# EAGLE design solderable_breadboard_mini (EAGLE 6.5.0)
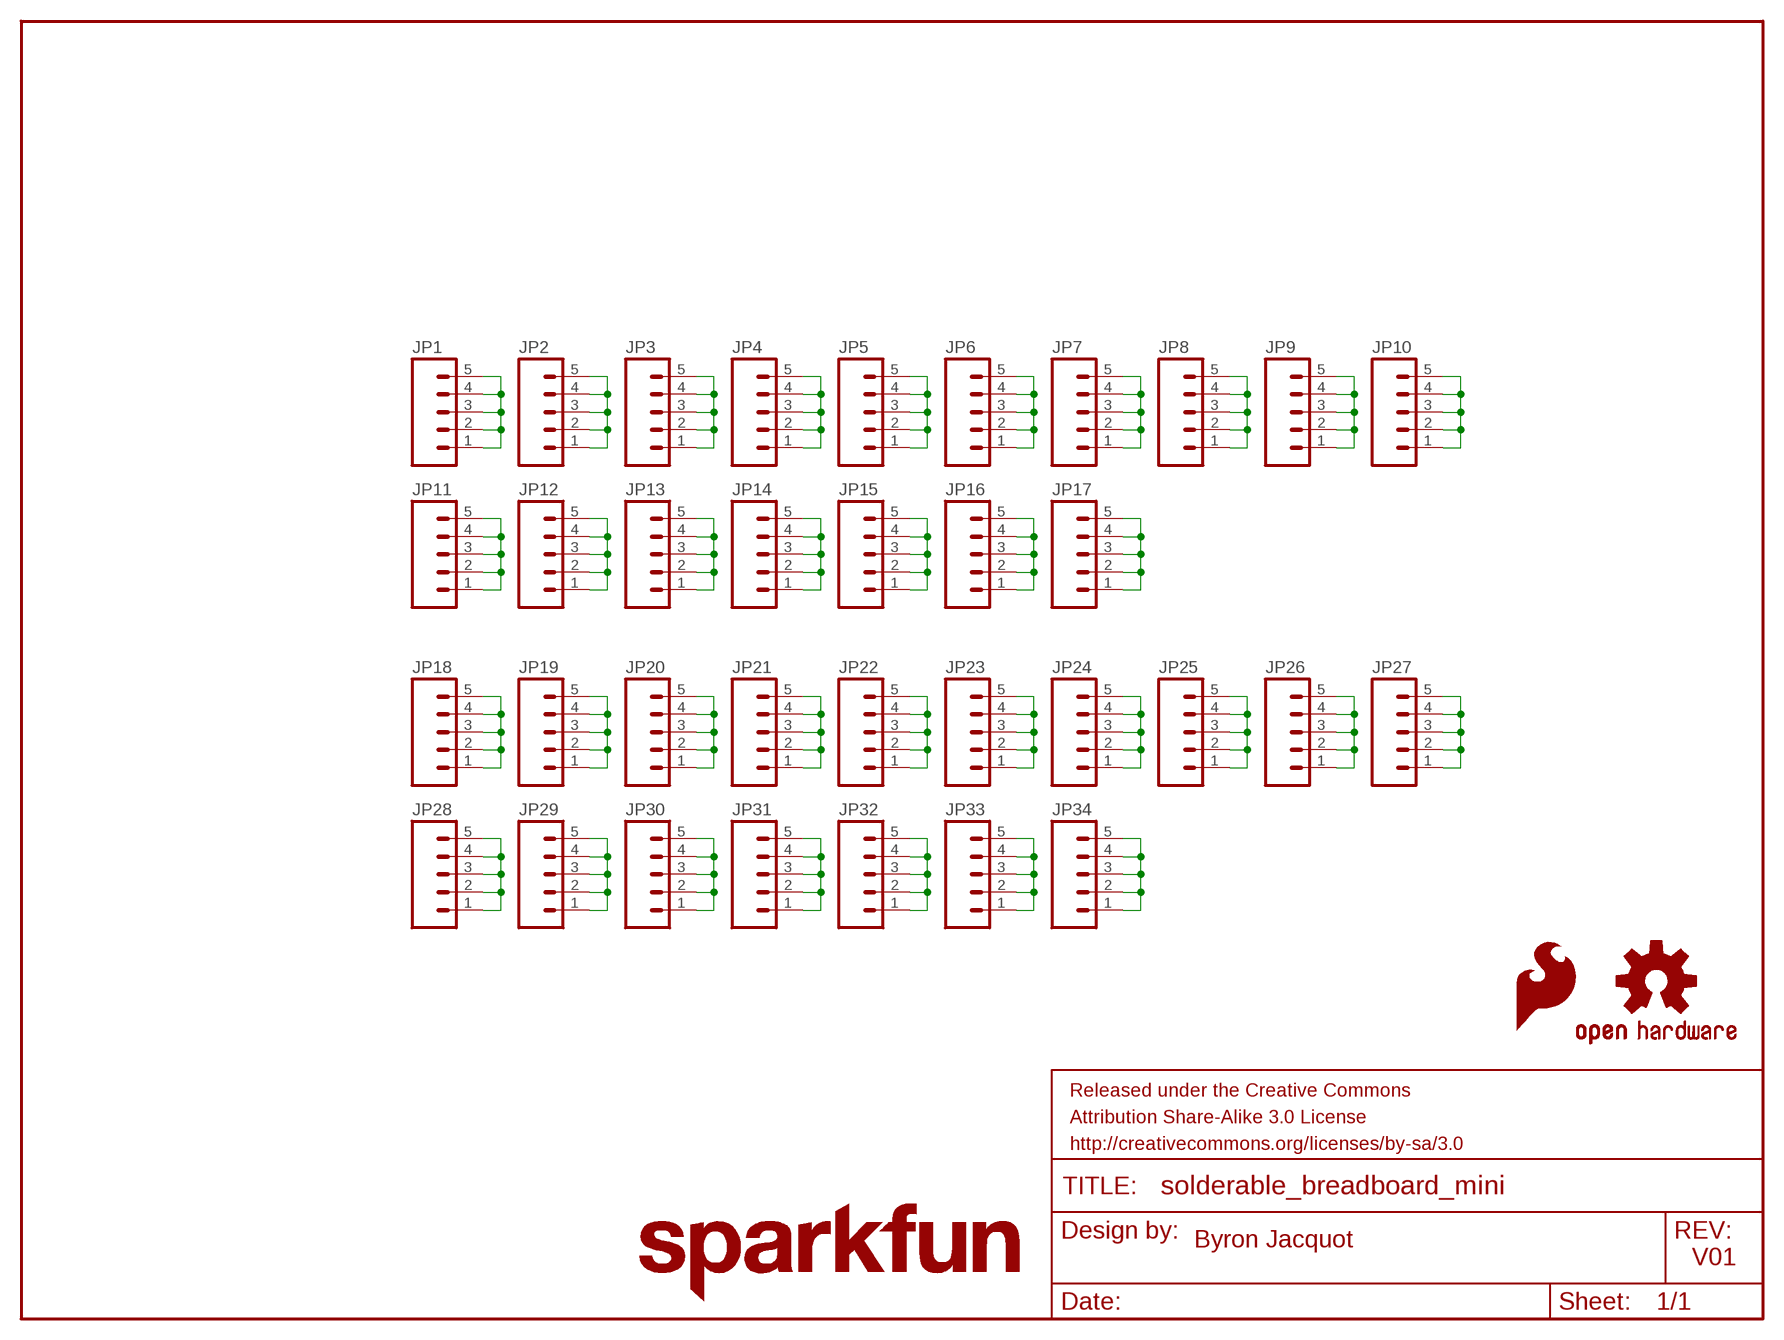
[diagram p0: schematic, sheet 1]

## Parts
FRAME1  FRAME-LETTER  [CREATIVE_COMMONS]
JP1  M05NO_SILK  [1X05_NO_SILK]
JP2  M05NO_SILK  [1X05_NO_SILK]
JP3  M05NO_SILK  [1X05_NO_SILK]
JP4  M05NO_SILK  [1X05_NO_SILK]
JP5  M05NO_SILK  [1X05_NO_SILK]
JP6  M05NO_SILK  [1X05_NO_SILK]
JP7  M05NO_SILK  [1X05_NO_SILK]
JP8  M05NO_SILK  [1X05_NO_SILK]
JP9  M05NO_SILK  [1X05_NO_SILK]
JP10  M05NO_SILK  [1X05_NO_SILK]
JP11  M05NO_SILK  [1X05_NO_SILK]
JP12  M05NO_SILK  [1X05_NO_SILK]
JP13  M05NO_SILK  [1X05_NO_SILK]
JP14  M05NO_SILK  [1X05_NO_SILK]
JP15  M05NO_SILK  [1X05_NO_SILK]
JP16  M05NO_SILK  [1X05_NO_SILK]
JP17  M05NO_SILK  [1X05_NO_SILK]
JP18  M05NO_SILK  [1X05_NO_SILK]
JP19  M05NO_SILK  [1X05_NO_SILK]
JP20  M05NO_SILK  [1X05_NO_SILK]
JP21  M05NO_SILK  [1X05_NO_SILK]
JP22  M05NO_SILK  [1X05_NO_SILK]
JP23  M05NO_SILK  [1X05_NO_SILK]
JP24  M05NO_SILK  [1X05_NO_SILK]
JP25  M05NO_SILK  [1X05_NO_SILK]
JP26  M05NO_SILK  [1X05_NO_SILK]
JP27  M05NO_SILK  [1X05_NO_SILK]
JP28  M05NO_SILK  [1X05_NO_SILK]
JP29  M05NO_SILK  [1X05_NO_SILK]
JP30  M05NO_SILK  [1X05_NO_SILK]
JP31  M05NO_SILK  [1X05_NO_SILK]
JP32  M05NO_SILK  [1X05_NO_SILK]
JP33  M05NO_SILK  [1X05_NO_SILK]
JP34  M05NO_SILK  [1X05_NO_SILK]
LOGO1  SFE_LOGO_NAME.1_INCH  [SFE_LOGO_NAME_.1]
LOGO2  OSHW-LOGOM  [OSHW-LOGO-M]
LOGO3  SFE_LOGO_FLAME.1_INCH  [SFE_LOGO_FLAME_.1]
LOGO4  SFE_LOGO_FLAME.1_INCH  [SFE_LOGO_FLAME_.1]

## Nets
N$1: JP1.1 JP1.2 JP1.3 JP1.4 JP1.5
N$2: JP2.1 JP2.2 JP2.3 JP2.4 JP2.5
N$3: JP3.1 JP3.2 JP3.3 JP3.4 JP3.5
N$4: JP4.1 JP4.2 JP4.3 JP4.4 JP4.5
N$5: JP5.1 JP5.2 JP5.3 JP5.4 JP5.5
N$6: JP6.1 JP6.2 JP6.3 JP6.4 JP6.5
N$7: JP7.1 JP7.2 JP7.3 JP7.4 JP7.5
N$8: JP8.1 JP8.2 JP8.3 JP8.4 JP8.5
N$9: JP9.1 JP9.2 JP9.3 JP9.4 JP9.5
N$10: JP10.1 JP10.2 JP10.3 JP10.4 JP10.5
N$11: JP11.1 JP11.2 JP11.3 JP11.4 JP11.5
N$12: JP12.1 JP12.2 JP12.3 JP12.4 JP12.5
N$13: JP13.1 JP13.2 JP13.3 JP13.4 JP13.5
N$14: JP14.1 JP14.2 JP14.3 JP14.4 JP14.5
N$15: JP15.1 JP15.2 JP15.3 JP15.4 JP15.5
N$16: JP16.1 JP16.2 JP16.3 JP16.4 JP16.5
N$17: JP17.1 JP17.2 JP17.3 JP17.4 JP17.5
N$18: JP18.1 JP18.2 JP18.3 JP18.4 JP18.5
N$19: JP19.1 JP19.2 JP19.3 JP19.4 JP19.5
N$20: JP20.1 JP20.2 JP20.3 JP20.4 JP20.5
N$21: JP21.1 JP21.2 JP21.3 JP21.4 JP21.5
N$22: JP22.1 JP22.2 JP22.3 JP22.4 JP22.5
N$23: JP23.1 JP23.2 JP23.3 JP23.4 JP23.5
N$24: JP24.1 JP24.2 JP24.3 JP24.4 JP24.5
N$25: JP25.1 JP25.2 JP25.3 JP25.4 JP25.5
N$26: JP26.1 JP26.2 JP26.3 JP26.4 JP26.5
N$27: JP27.1 JP27.2 JP27.3 JP27.4 JP27.5
N$28: JP28.1 JP28.2 JP28.3 JP28.4 JP28.5
N$29: JP29.1 JP29.2 JP29.3 JP29.4 JP29.5
N$30: JP30.1 JP30.2 JP30.3 JP30.4 JP30.5
N$31: JP31.1 JP31.2 JP31.3 JP31.4 JP31.5
N$32: JP32.1 JP32.2 JP32.3 JP32.4 JP32.5
N$33: JP33.1 JP33.2 JP33.3 JP33.4 JP33.5
N$34: JP34.1 JP34.2 JP34.3 JP34.4 JP34.5

## Notes on the sheet
- Byron Jacquot
- V01

## Library data of the parts
FRAME1 = SparkFun-Aesthetics:FRAME-LETTER: Schematic Frame Standard 8.5x11 US Letter frame
JP1-JP34 = SparkFun-Connectors:M05: Header 5 Standard 5-pin 0.1" header. Use with straight break away headers (SKU : PRT-00116), right angle break away headers (PRT-00553), swiss pins (PRT-00743), machine pins (PRT-00117), and female headers (PRT-00115). Molex polarized connector foot print use with SKU : PRT-08230 with associated crimp pins and housings.
LOGO1 = SparkFun-Aesthetics:SFE_LOGO_NAME: SFE Logo, name only This is the SparkFun name logo. The logo on the schematic will always be the same size; the package variant is the height of the flame part of the logo (or the height the flame would be, if it were drawn). Default layer for the logo on the board is tSilk.
LOGO2 = SparkFun-Aesthetics:OSHW-LOGO: Open Source Hardware Logo This logo indicates the piece of hardware it is found on incorporates a OSHW license and/or adheres to the definition of open source hardware found here: http://freedomdefined.org/OSHW
LOGO3 LOGO4 = SparkFun-Aesthetics:SFE_LOGO_FLAME: SFE Logo, flame only This is the SparkFun flame logo. The logo on the schematic will always be the same size; the package variant is the height of the flame. Default layer for the logo on the board is tSilk.

## Board
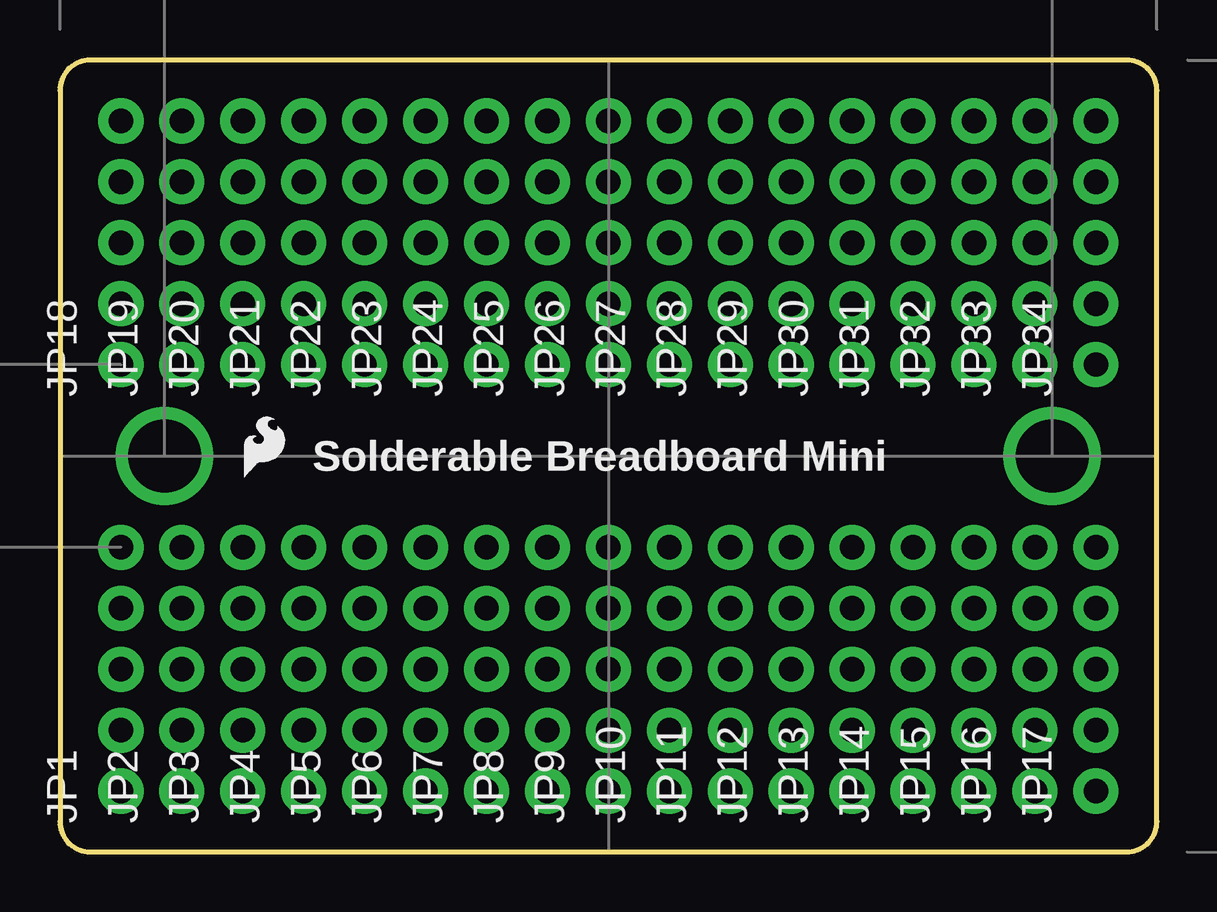
[diagram p1: board, top side]
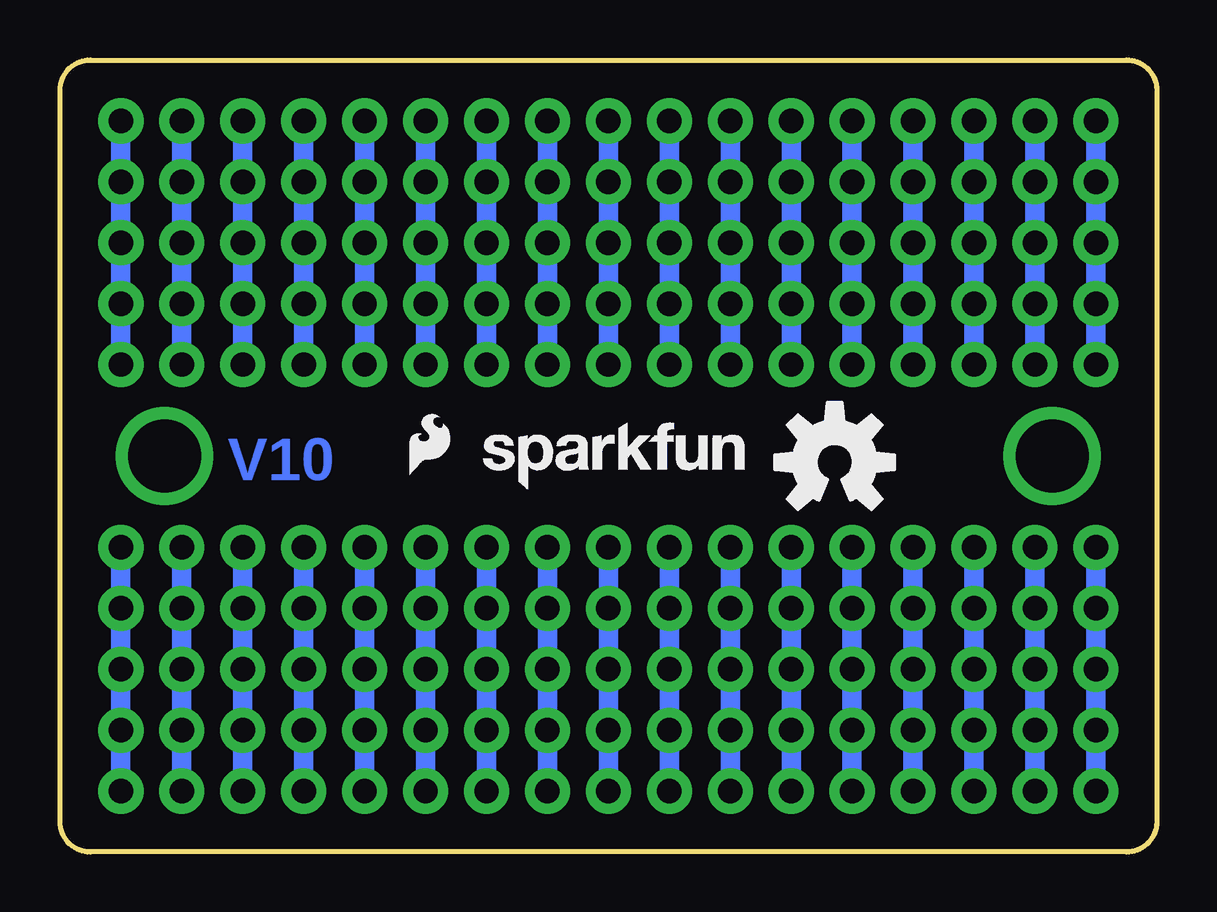
[diagram p2: board, bottom side, seen from below]

Size 45.72 x 33.02 mm. Coordinates in mm from the lower left corner, seen from the top.
Outline: 0,31.75 0,1.27 arc90 1.27,0 44.45,0 arc90 45.72,1.27 45.72,31.75 arc90 44.45,33.02 1.27,33.02 arc90 0,31.75
Copper layers (1*16): Top 0.035mm / dielectric 1.5mm / Bottom 0.035mm
Design rules "SparkFun-2-layer": minimum track width 7mil, minimum drill 15mil, track to track 8mil, track to pad 8mil, pad to pad 8mil, via to via 8mil, smd to smd 8mil, copper to edge 8mil, drill to drill 8mil, minimum pad ring 12mil, minimum via ring 10mil, stop-mask expansion 4mil, vias tented up to drill 20mil, thermal gap 10mil

### Footprints (pad centres in the part's own frame; a part is rotated, then mirrored left to right if it is on the bottom)
1X05_NO_SILK = drill 1.016 pad 1.88: 1 0,0; 2 2.54,0; 3 5.08,0; 4 7.62,0; 5 10.16,0

### Placement (x,y rotation side)
FRAME1  5.08,-10.16 0 top  (outside the outline)
JP1  2.54,2.54 90 top
JP2  5.08,2.54 90 top
JP3  7.62,2.54 90 top
JP4  10.16,2.54 90 top
JP5  12.7,2.54 90 top
JP6  15.24,2.54 90 top
JP7  17.78,2.54 90 top
JP8  20.32,2.54 90 top
JP9  22.86,2.54 90 top
JP10  25.4,2.54 90 top
JP11  27.94,2.54 90 top
JP12  30.48,2.54 90 top
JP13  33.02,2.54 90 top
JP14  35.56,2.54 90 top
JP15  38.1,2.54 90 top
JP16  40.64,2.54 90 top
JP17  43.18,2.54 90 top
JP18  2.54,20.32 90 top
JP19  5.08,20.32 90 top
JP20  7.62,20.32 90 top
JP21  10.16,20.32 90 top
JP22  12.7,20.32 90 top
JP23  15.24,20.32 90 top
JP24  17.78,20.32 90 top
JP25  20.32,20.32 90 top
JP26  22.86,20.32 90 top
JP27  25.4,20.32 90 top
JP28  27.94,20.32 90 top
JP29  30.48,20.32 90 top
JP30  33.02,20.32 90 top
JP31  35.56,20.32 90 top
JP32  38.1,20.32 90 top
JP33  40.64,20.32 90 top
JP34  43.18,20.32 90 top
LOGO1  28.57,14.61 0 bottom
LOGO2  13.43,16.26 0 bottom
LOGO3  7.37,15.27 0 top
LOGO4  31.46,15.37 0 bottom

### Tracks (layer width: path | path; a pad name or v marks a point on that pad's centre or on a via)
N$1
  Bottom 0.813: JP1.1 JP1.2 JP1.3 JP1.4 JP1.5
N$2
  Bottom 0.813: JP2.5 JP2.4 JP2.3 JP2.2 JP2.1
N$3
  Bottom 0.813: JP3.1 JP3.2 JP3.3 JP3.4 JP3.5
N$4
  Bottom 0.813: JP4.1 JP4.2 JP4.3 JP4.4 JP4.5
N$5
  Bottom 0.813: JP5.1 JP5.2 JP5.3 JP5.4 JP5.5
N$6
  Bottom 0.813: JP6.1 JP6.2 JP6.3 JP6.4 JP6.5
N$7
  Bottom 0.813: JP7.5 JP7.4 JP7.3 JP7.2 JP7.1
N$8
  Bottom 0.813: JP8.1 JP8.2 JP8.3 JP8.4 JP8.5
N$9
  Bottom 0.813: JP9.5 JP9.4 JP9.3 JP9.2 JP9.1
N$10
  Bottom 0.813: JP10.1 JP10.2 JP10.3 JP10.4 JP10.5
N$11
  Bottom 0.813: JP11.5 JP11.4 JP11.3 JP11.2 JP11.1
N$12
  Bottom 0.813: JP12.1 JP12.2 JP12.3 JP12.4 JP12.5
N$13
  Bottom 0.813: JP13.5 JP13.4 JP13.3 JP13.2 JP13.1
N$14
  Bottom 0.813: JP14.1 JP14.2 JP14.3 JP14.4 JP14.5
N$15
  Bottom 0.813: JP15.5 JP15.4 JP15.3 JP15.2 JP15.1
N$16
  Bottom 0.813: JP16.1 JP16.2 JP16.3 JP16.4 JP16.5
N$17
  Bottom 0.813: JP17.5 JP17.4 JP17.3 JP17.2 JP17.1
N$18
  Bottom 0.813: JP18.5 JP18.4 JP18.3 JP18.2 JP18.1
N$19
  Bottom 0.813: JP19.1 JP19.2 JP19.3 JP19.4 JP19.5
N$20
  Bottom 0.813: JP20.5 JP20.4 JP20.3 JP20.2 JP20.1
N$21
  Bottom 0.813: JP21.1 JP21.2 JP21.3 JP21.4 JP21.5
N$22
  Bottom 0.813: JP22.5 JP22.4 JP22.3 JP22.2 JP22.1
N$23
  Bottom 0.813: JP23.1 JP23.2 JP23.3 JP23.4 JP23.5
N$24
  Bottom 0.813: JP24.5 JP24.4 JP24.3 JP24.2 JP24.1
N$25
  Bottom 0.813: JP25.1 JP25.2 JP25.3 JP25.4 JP25.5
N$26
  Bottom 0.813: JP26.5 JP26.4 JP26.3 JP26.2 JP26.1
N$27
  Bottom 0.813: JP27.1 JP27.2 JP27.3 JP27.4 JP27.5
N$28
  Bottom 0.813: JP28.5 JP28.4 JP28.3 JP28.2 JP28.1
N$29
  Bottom 0.813: JP29.1 JP29.2 JP29.3 JP29.4 JP29.5
N$30
  Bottom 0.813: JP30.5 JP30.4 JP30.3 JP30.2 JP30.1
N$31
  Bottom 0.813: JP31.1 JP31.2 JP31.3 JP31.4 JP31.5
N$32
  Bottom 0.813: JP32.5 JP32.4 JP32.3 JP32.2 JP32.1
N$33
  Bottom 0.813: JP33.1 JP33.2 JP33.3 JP33.4 JP33.5
N$34
  Bottom 0.813: JP34.5 JP34.4 JP34.3 JP34.2 JP34.1
N$35  (via drill 3.05)
  other vias: 4.36,16.51
N$36  (via drill 3.05)
  other vias: 41.36,16.51

### Text on the board
Bottom: V10
tPlace: Solderable Breadboard Mini
tDocu: Byron Jacquot